# Altium project UVM AERO BSPD.PrjPcb (part 1 of 2)
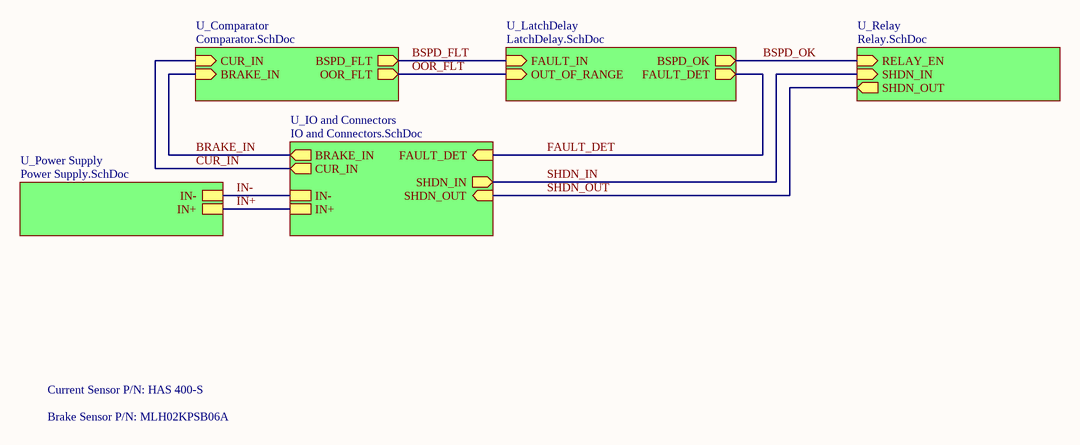
[diagram p0: TOP.SchDoc]
ProjAuth: Andrew Katz; ProjName: BSPD
7 sheets, 126 parts. Net scope: hierarchical (ports join the sheet entries above them; power ports are global).
Board file: UVM AERO BSPD.PcbDoc
Sheets:
  TOP.SchDoc
    U_Comparator = Comparator.SchDoc
    U_LatchDelay = LatchDelay.SchDoc
    U_Power Supply = Power Supply.SchDoc
    U_Relay = Relay.SchDoc
    U_IO and Connectors = IO and Connectors.SchDoc
      U_Current Scaler = Current Scaler.SchDoc

## Sheet TOP.SchDoc
size Letter; CompanyName: UVM AERO; DocumentNumber: 1; Revision: A01; SheetNumber: 1; SheetTotal: 7; DescLong2_DescShort: -

### Sub-sheets
U_Comparator = Comparator.SchDoc: OOR_FLT (out), CUR_IN (in), BSPD_FLT (out), BRAKE_IN (in)
U_IO and Connectors = IO and Connectors.SchDoc: SHDN_OUT (in), SHDN_IN (out), IN+, IN-, FAULT_DET (in), CUR_IN (out), BRAKE_IN (out)
U_LatchDelay = LatchDelay.SchDoc: FAULT_IN (in), FAULT_DET (out), BSPD_OK (out), OUT_OF_RANGE (in)
U_Power Supply = Power Supply.SchDoc: IN-, IN+
U_Relay = Relay.SchDoc: RELAY_EN (in), SHDN_IN (in), SHDN_OUT (out)

### Nets
BRAKE_IN: sheet U_Comparator/BRAKE_IN, sheet U_IO and Connectors/BRAKE_IN
BSPD_FLT: sheet U_Comparator/BSPD_FLT, sheet U_LatchDelay/FAULT_IN
BSPD_OK: sheet U_LatchDelay/BSPD_OK, sheet U_Relay/RELAY_EN
CUR_IN: sheet U_Comparator/CUR_IN, sheet U_IO and Connectors/CUR_IN
FAULT_DET: sheet U_LatchDelay/FAULT_DET, sheet U_IO and Connectors/FAULT_DET
IN+: sheet U_Power Supply/IN+, sheet U_IO and Connectors/IN+
IN-: sheet U_Power Supply/IN-, sheet U_IO and Connectors/IN-
OOR_FLT: sheet U_Comparator/OOR_FLT, sheet U_LatchDelay/OUT_OF_RANGE
SHDN_IN: sheet U_Relay/SHDN_IN, sheet U_IO and Connectors/SHDN_IN
SHDN_OUT: sheet U_Relay/SHDN_OUT, sheet U_IO and Connectors/SHDN_OUT

### Notes on the sheet
- Current Sensor P/N: HAS 400-S
- Brake Sensor P/N: MLH02KPSB06A
- Title:
- Size:
- Date:
- Desc:
- Letter
- Auth:
- Sheet
- Proj:
- of
- www.uvmaero.org
- File:

## Sheet Comparator.SchDoc
size Letter; DocumentNumber: 3; SheetNumber: 3; SheetTotal: 7
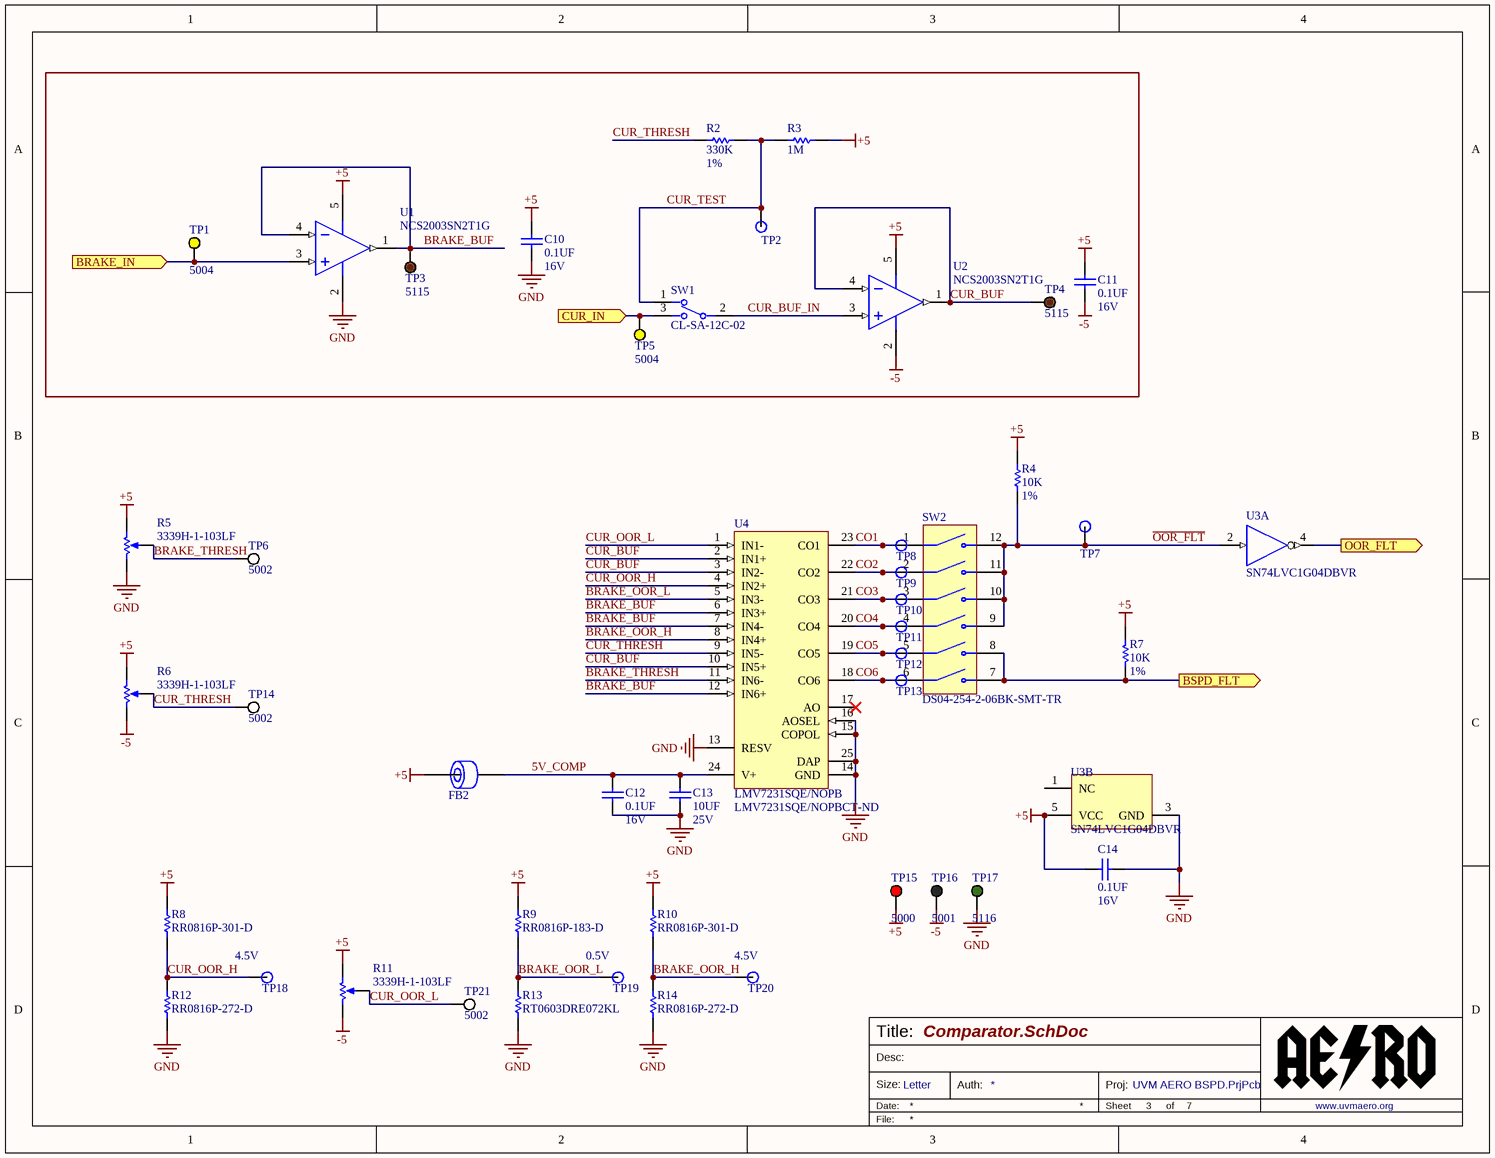
[diagram p1: Comparator.SchDoc]

### Parts
C10  Val: 0.1UF  Vol: 16V  [0603_CAP]  (hidden comment: CAP 0603 0.1UF 16V 10% X7R)
C11  Val: 0.1UF  Vol: 16V  [0603_CAP]  (hidden comment: CAP 0603 0.1UF 16V 10% X7R)
C12  Val: 0.1UF  Vol: 16V  [0603_CAP]  (hidden comment: CAP 0603 0.1UF 16V 10% X7R)
C13  Val: 10UF  Vol: 25V  [0603_CAP]  (hidden comment: CAP 0603 10UF 25V 20% X5R)
C14  Val: 0.1UF  Vol: 16V  [0603_CAP]  (hidden comment: CAP 0603 0.1UF 16V 10% X7R)
FB2  Ferrite Chip 120 Ohms  [0603]  (value not drawn)
R2  Val: 330K  Tol: 1%  [0603_RES]  (hidden comment: RES 0603 330K 1%)
R3  value 1M  [RESC2013X60X35ML10T20]  (hidden comment: RT0805BRE071ML)
R4  Val: 10K  Tol: 1%  [0603_RES]  (hidden comment: RES 0603 10K 1%)
R5  3339H-1-103LF  [3339H-1-103LF]
R6  3339H-1-103LF  [3339H-1-103LF]
R7  Val: 10K  Tol: 1%  [0603_RES]  (hidden comment: RES 0603 10K 1%)
R8  RR0816P-301-D  [RESC1608X50X30ML20T20]
R9  RR0816P-183-D  [RESC1608X50X30ML20T20]
R10  RR0816P-301-D  [RESC1608X50X30ML20T20]
R11  3339H-1-103LF  [3339H-1-103LF]
R12  RR0816P-272-D  [RESC1608X50X30NL20T20]
R13  RT0603DRE072KL  [RESC1608X55X25NL10T15]
R14  RR0816P-272-D  [RESC1608X50X30NL20T20]
SW1  CL-SA-12C-02  [CL-SA-12C-02]
SW2  DS04-254-2-06BK-SMT-TR  [*SW_DS04-254-2-06BK-SMT-TR]
TP1  5004  [KSTN-5004]
TP2  SMD Test Point  [TP_40mil]  (value not drawn)  (no BOM)
TP3  5115  [KSTN-5115]
TP4  5115  [KSTN-5115]
TP5  5004  [KSTN-5004]
TP6  5002  [KSTN-5002]
TP7  SMD Test Point  [TP_40mil]  (value not drawn)  (no BOM)
TP8  SMD Test Point  [TP_40mil]  (value not drawn)  (no BOM)
TP9  SMD Test Point  [TP_40mil]  (value not drawn)  (no BOM)
TP10  SMD Test Point  [TP_40mil]  (value not drawn)  (no BOM)
TP11  SMD Test Point  [TP_40mil]  (value not drawn)  (no BOM)
TP12  SMD Test Point  [TP_40mil]  (value not drawn)  (no BOM)
TP13  SMD Test Point  [TP_40mil]  (value not drawn)  (no BOM)
TP14  5002  [KSTN-5002]
TP15  5000  [KSTN-5000]
TP16  5001  [KSTN-5001]
TP17  5116  [KSTN-5116]
TP18  SMD Test Point  [TP_40mil]  (value not drawn)  (no BOM)
TP19  SMD Test Point  [TP_40mil]  (value not drawn)  (no BOM)
TP20  SMD Test Point  [TP_40mil]  (value not drawn)  (no BOM)
TP21  5002  [KSTN-5002]
U1  NCS2003SN2T1G  [ONSC-TSOP-5-483-02_V]
U2  NCS2003SN2T1G  [ONSC-TSOP-5-483-02_V]
U3  SN74LVC1G04DBVR  [DBV0005A_M]  (parts A,B of 2)
U4  LMV7231SQE/NOPB  Supplier Part Number 1: LMV7231SQE/NOPBCT-ND  [RTW0024A_V]

### Ports
BRAKE_IN (in), BSPD_FLT (out), CUR_IN (in), OOR_FLT (out)

### Nets
+5: C10.2 C11.2 C14.2 FB2.1 R3.2 R4.2 R5.1(CCW) R6.1(CCW) R7.1 R8.2 R9.2 R10.2 R11.1(CCW) TP15.1 U1.5(VDD) U2.5(VDD) U3.5(VCC)
-5: C11.1 R6.3(CW) R11.3(CW) TP16.1 U2.2(VSS)
GND: C10.1 C12.1 C13.1 C14.1 R5.3(CW) R12.1 R13.1 R14.1 TP17.1 U1.2(VSS) U3.3(GND) U4.13(RESV) U4.14(GND) U4.15(COPOL) U4.16(AOSEL) U4.25(DAP)
5V_COMP: C12.2 C13.2 FB2.2 U4.24(V+)
~{OOR_FLT}: R4.1 SW2.9(NO4) SW2.10(NO3) SW2.11(NO2) SW2.12(NO1) TP7.1 U3.2(A)
BRAKE_BUF: TP3.1 U1.1(VOUT) U1.4(IN-) U4.6(IN3+) U4.7(IN4-) U4.12(IN6+)
BRAKE_IN: TP1.1 U1.3(IN+) ; port BRAKE_IN
BRAKE_OOR_H: R10.1 R14.2 TP20.1 U4.8(IN4+)
BRAKE_OOR_L: R9.1 R13.2 TP19.1 U4.5(IN3-)
BRAKE_THRESH: R5.2(WIPER) TP6.1 U4.11(IN6-)
BSPD_FLT: R7.2 SW2.7(NO6) SW2.8(NO5) ; port BSPD_FLT
CO1: SW2.1(COM1) TP8.1 U4.23(CO1)
CO2: SW2.2(COM2) TP9.1 U4.22(CO2)
CO3: SW2.3(COM3) TP10.1 U4.21(CO3)
CO4: SW2.4(COM4) TP11.1 U4.20(CO4)
CO5: SW2.5(COM5) TP12.1 U4.19(CO5)
CO6: SW2.6(COM6) TP13.1 U4.18(CO6)
CUR_BUF: TP4.1 U2.1(VOUT) U2.4(IN-) U4.2(IN1+) U4.3(IN2-) U4.10(IN5+)
CUR_BUF_IN: SW1.2 U2.3(IN+)
CUR_IN: SW1.3 TP5.1 ; port CUR_IN
CUR_OOR_H: R8.1 R12.2 TP18.1 U4.4(IN2+)
CUR_OOR_L: R11.2(WIPER) TP21.1 U4.1(IN1-)
CUR_TEST: R2.2 R3.1 SW1.1 TP2.1
CUR_THRESH: R2.1 R6.2(WIPER) TP14.1 U4.9(IN5-)
OOR_FLT: U3.4(Y) ; port OOR_FLT

Not connected (* = marked no-connect by the designer): U3 1(NC); U4 17(AO)*

### Notes on the sheet
- (near TP18) 4.5V
- (near TP19) 0.5V
- (near TP20) 4.5V
- Title:
- Size:
- Date:
- Desc:
- Letter
- Auth:
- Sheet
- Proj:
- of
- www.uvmaero.org
- File:

### Library data of the parts
C10-C12 C14 = CAP 0603 0.1UF 16V 10% X7R: Capacitor Surface Mount 0603 Footprint 0.1UF 16V 10% Tolerance Ceramic X7R; Manufacturer: Various; PCB Package: 0603; Description in Visual: Cap SMT 0603 0.1UF 16V 10%  Cer X7R; P/N: CAP 0603 0.1UF 16V 10% X7R; Manufacturer P/N: Various; Value: 0.1UF; Voltage: 16V; Tolerance: 10%; Type: Ceramic X7R; ComponentLink1Description: Manufacturer Website; ComponentLink2Description: Component Datasheet; ComponentLink3Description: Octopart Link
C13 = CAP 0603 10UF 25V 20% X5R: Capacitor Surface Mount 0603 Footprint 10UF 25V 20% Tolerance Ceramic X5R; Manufacturer: Various; PCB Package: 0603; Description in Visual: Cap SMT 0603 10UF 25V 20% Ceramic X5R; P/N: CAP 0603 10UF 25V 20% X5R; Manufacturer P/N: Various; Value: 10UF; Voltage: 25V; Tolerance: 20%; Type: Ceramic X5R; ComponentLink1Description: Manufacturer Website; ComponentLink2Description: Component Datasheet; ComponentLink3Description: Octopart Link
FB2 = MMZ1608S121A: Ferrite Chip 500 mA 120 Ohms Differential Mode - Single 0603 Footprint; Manufacturer: TDK; Description in Visual: Ferrite SMT 500mA 120Ohm Dif Mode 0603; Usage: Signal Line; Current (mA): 500; Frequency: 100 MHz; Impedance at Freq (ohms): 120; DC Resistance (ohms): 0.2; P/N: MMZ1608S121A; Manufacturer P/N: MMZ1608S121A; Filter type: Differential Mode - Single; Operating Temperature Range: -55 to +125 °C; PCB Package: 0603; ComponentLink1Description: Manufacturer Website; ComponentLink1URL: http://www.tdk.com/; ComponentLink2Description: Component Datasheet; ComponentLink2URL: http://www.tdk.co.jp/tefe02/e9412_mmz1608.pdf; ComponentLink3Description: Octopart Link; ComponentLink3URL: http://octopart.com/partsearch/#search/requestData&q=MMZ1608S121A
R2 = RES 0603 330K 1%: Resistor Surface Mount, 330K Ohms, 0603 Footprint, 1% Tolerance 0.1W; Manufacturer: Various; PCB Package: 0603; Description in Visual: Res SMT 330K 0603  1%  0.1W; P/N: RES 0603 330K 1%; Manufacturer P/N: Various; Value: 330K; Power_Rating: 0.1W; Tolerance: 1%
R3 = CMP-2001-01491-1: Manufacturer: Yageo; Part Number: RT0805BRE071ML
R4 R7 = RES 0603 10K 1%: Resistor Surface Mount, 10K Ohms, 0603 Footprint, 1% Tolerance 0.1W; Manufacturer: Various; PCB Package: 0603; Description in Visual: Res SMT 10K 0603  1%  0.1W; P/N: RES 0603 10K 1%; Manufacturer P/N: Various; Value: 10K; Power_Rating: 0.1W; Tolerance: 1%
R5 R6 R11 = 3339H-1-103LF: 10 kOhms 0.5W, 1/2W PC Pins Through Hole Trimmer Potentiometer Cermet 4 Turn Top Adjustment; ComponentLink2URL: https://www.ttelectronics.com/TTElectronics/media/ProductFiles/Trimmers/Datasheets/67.pdf; ComponentLink2Description: Datasheet; Supplier 1: Digi-Key; Supplier Part Number 1: 3339H-103LF-ND
R8 R10 = CMP-2000-02599-1: Manufacturer: Susumu; Part Number: RR0816P-301-D
R9 = CMP-2000-02514-1: Manufacturer: Susumu; Part Number: RR0816P-183-D
R12 R14 = CMP-2000-02579-1: Manufacturer: Susumu; Part Number: RR0816P-272-D
R13 = CMP-2000-04621-1: Manufacturer: Yageo; Part Number: RT0603DRE072KL
SW1 = CL-SA-12C-02: Slide Switch SPDT Through Hole; Supplier 1: Digi-Key; Supplier Part Number 1: 563-1388-ND
SW2 = DS04-254-2-06BK-SMT-TR: Dip Switch SPST 6 Position Surface Mount Slide (Standard) Actuator 25mA 24VDC; Value: *; Supplier 1: Mouser; Supplier 2: Mouser; Supplier Part Number 2: 490-DS04254206BK-STR; Supplier Part Number 1: 490-DS04254206BK-STR
TP1 TP5 = 5004: Test Point, Yellow, 1-Pin THD, RoHS, Bulk; Manufacturer: KeystoneElectronics; Outside Diameter: 2.54mm; Plating: Silver; Mounting Hole Size: 1mm; Product: TestPoints; Packaging: Bulk; Manufacturer URL: http://www.keyelco.com/; Length: 7.62mm; Datasheet Version: Rev. G, 12/2008; Type: Miniature; Product Category: CircuitBoardHardware-PCB; Material: Nylon; RoHS: True; Contact Material: PhosphorBronze; Datasheet URL: https://ciiva.com/datasheet-click-2917627?src=ciiva&sig=bd195616; Color: Yellow; Brand: KeystoneElectronics; Supplier 1: Digi-Key; Supplier Part Number 1: 36-5004-ND
TP2 TP7-TP13 TP18-TP20 = TP_SMD
TP3 TP4 = 5115: Test Point, Brown, 1-Pin THD, RoHS, Bulk; Manufacturer: KeystoneElectronics; Outside Diameter: 2.54mm; Plating: Silver; Mounting Hole Size: 1mm; Product: TestPoints; Packaging: Bulk; Manufacturer URL: http://www.keyelco.com/; Length: 7.62mm; Datasheet Version: Rev. G, 12/2008; Type: Miniature; Product Category: CircuitBoardHardware-PCB; Material: Nylon; RoHS: True; Contact Material: PhosphorBronze; Datasheet URL: https://ciiva.com/datasheet-click-2917627?src=ciiva&sig=bd195616; Color: Brown; Brand: KeystoneElectronics; Supplier 1: Digi-Key; Supplier Part Number 1: 36-5115-ND
TP6 TP14 TP21 = 5002: Test Point, White, 1-Pin THD, RoHS, Bulk; Manufacturer: KeystoneElectronics; Outside Diameter: 2.54mm; Plating: Silver; Mounting Hole Size: 1mm; Product: TestPoints; Packaging: Bulk; Manufacturer URL: http://www.keyelco.com/; Length: 7.62mm; Datasheet Version: Rev. G, 12/2008; Type: Miniature; Product Category: CircuitBoardHardware-PCB; Material: Nylon; RoHS: True; Contact Material: PhosphorBronze; Datasheet URL: https://ciiva.com/datasheet-click-2917627?src=ciiva&sig=bd195616; Color: White; Brand: KeystoneElectronics; Supplier 1: Digi-Key; Supplier Part Number 1: 36-5002-ND
TP15 = 5000: Test Point, Red, 1-Pin THD, RoHS, Bulk; Manufacturer: KeystoneElectronics; Outside Diameter: 2.54mm; Plating: Silver; Mounting Hole Size: 1mm; Product: TestPoints; Packaging: Bulk; Manufacturer URL: http://www.keyelco.com/; Length: 7.62mm; Datasheet Version: Rev. G, 12/2008; Type: Miniature; Product Category: CircuitBoardHardware-PCB; Material: Nylon; RoHS: True; Contact Material: PhosphorBronze; Datasheet URL: https://ciiva.com/datasheet-click-2917627?src=ciiva&sig=bd195616; Color: Red; Brand: KeystoneElectronics; Supplier 1: Digi-Key; Supplier Part Number 1: 36-5000-ND
TP16 = 5001: Test Point, Black, 1-Pin THD, RoHS, Bulk; Manufacturer: KeystoneElectronics; Outside Diameter: 2.54mm; Plating: Silver; Mounting Hole Size: 1mm; Product: TestPoints; Packaging: Bulk; Manufacturer URL: http://www.keyelco.com/; Length: 7.62mm; Datasheet Version: Rev. G, 12/2008; Type: Miniature; Product Category: CircuitBoardHardware-PCB; Material: Nylon; RoHS: True; Contact Material: PhosphorBronze; Datasheet URL: https://ciiva.com/datasheet-click-2917627?src=ciiva&sig=bd195616; Color: Black; Brand: KeystoneElectronics; Supplier 1: Digi-Key; Supplier Part Number 1: 36-5001-ND
TP17 = 5116: Test Point, Green, 1-Pin THD, RoHS, Bulk; Manufacturer: KeystoneElectronics; Outside Diameter: 2.54mm; Plating: Silver; Mounting Hole Size: 1mm; Product: TestPoints; Packaging: Bulk; Manufacturer URL: http://www.keyelco.com/; Length: 7.62mm; Datasheet Version: Rev. G, 12/2008; Type: Miniature; Product Category: CircuitBoardHardware-PCB; Material: Nylon; RoHS: True; Contact Material: PhosphorBronze; Datasheet URL: https://ciiva.com/datasheet-click-2917627?src=ciiva&sig=bd195616; Color: Green; Brand: KeystoneElectronics; Supplier 1: Digi-Key; Supplier Part Number 1: 36-5116-ND
U1 U2 = CMP-1310-00381-1: Low Voltage, Rail-to-Rail Output Operational Amplifier, 1.7 to 5.5 V, -40 to 85 degC, 5-Pin TSOP, Pb-Free, Tape and Reel; Manufacturer: On Semiconductor; VCC Max (V): 5.5; VCC Min (V): 1.7; ComponentLink3URL: http://www.onsemi.com/pub_link/Collateral/483.PDF; Packing: Tape and Reel; ComponentLink1URL: http://www.onsemi.com/; PackageReference: TSOP-5-483-02; Mounting Technology: Surface Mount; PackageVersion: Rev. K, 04/2013; PartNumber: NCS2003SN2T1G; DatasheetVersion: Rev. 3; ComponentLink2URL: http://www.onsemi.cn/pub_link/Collateral/NCS2003-D.PDF; ComponentLink2Description: Datasheet; ComponentLink3Description: Package Specification; RoHS: TRUE; PackageDescription: 5-Pin Small Outline Package, Body 3 x 1.5 mm, Pitch 0.95 mm; ComponentLink1Description: Manufacturer URL
U3 = CMP-0859-00134-3: Single Inverter, DBV0005A, LARGE T&R; Manufacturer: Texas Instruments; 3-State Output: No; Sub-Family: Inverting Buffer/Driver; Logic: Inverting; Rating: Catalog; VCC(Max)(V): 5.5; ICC @ Nom Voltage(Max)(mA): 0.01; Output Type: CMOS; Output Drive (IOL/IOH)(Max)(mA): 32/-32; tpd @ Nom Voltage(Max)(ns): 7.5,5.2,4.2,3.7; Technology Family: LVC; Input Type: CMOS/TTL; Bits(#): 1; F @ Nom Voltage(Max)(Mhz): 150; VCC(Min)(V): 1.65; Voltage(Nom)(V): 1.8,2.5,3.3,5; DatasheetVersion: SCES214AD; Schmitt Trigger: No; Operating Temperature Range(C): -40 to 125,-40 to 85; PackageReference: DBV0005A; Generic Part Number: SN74LVC1G04
U4 = LMV7231SQE/NOPB: Hex Window Comparator with 1.5% Precision and 400mV Reference, 24-pin LLP, 250 Reel; Manufacturer: Texas Instruments; PowerWise: N; PackageTopMarking: NS*UZXYTT*L7231SQ; Code_JEDEC: MO-220-WGGD-6; PinCount: 24; ComponentLink1Description: Datasheet URL; PackageDescription: LLP, Plastic, Quad, 4 x 4 x 0.8mm Body, 24 Lead, 0.5mm Pitch, No Pullback; PackageReference: RTW0024A; CompType: Comparator; RoHS: Y; ComponentLink1URL: http://www.ti.com/general/docs/lit/getliterature.tsp?genericPartNumber=LMV7231&fileType=pdf; Supplier 1: Digi-Key

## Sheet LatchDelay.SchDoc
size Letter; DocumentNumber: 4; SheetNumber: 4; SheetTotal: 7
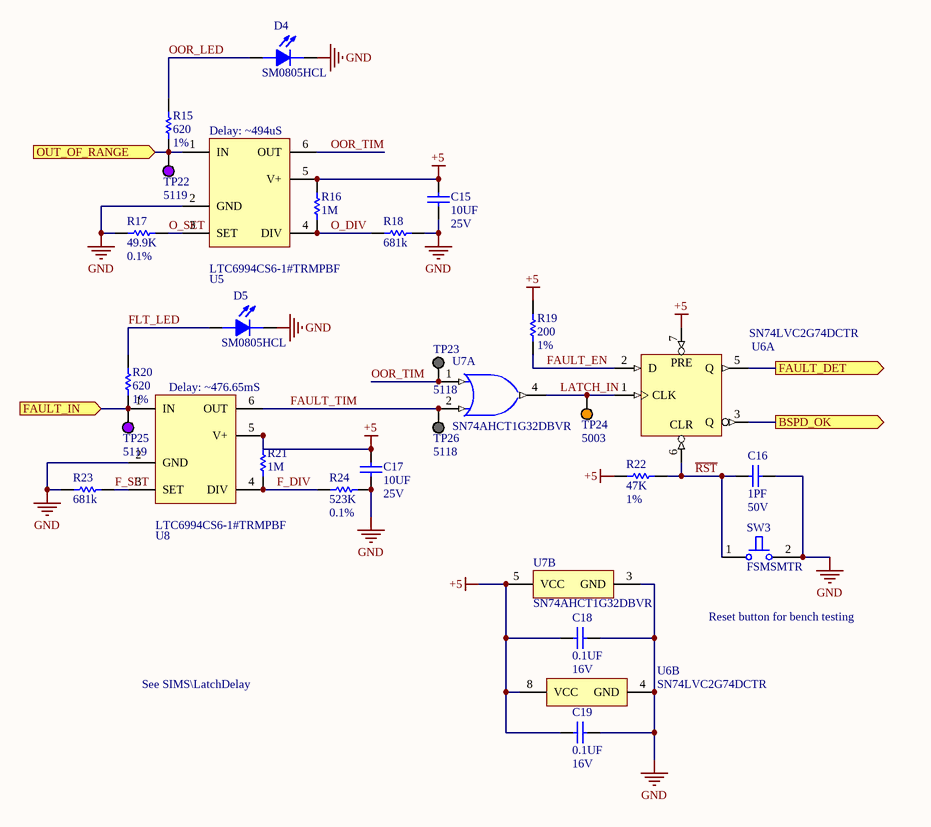
[diagram p2: LatchDelay.SchDoc]

### Parts
C15  Val: 10UF  Vol: 25V  [0603_CAP]  (hidden comment: CAP 0603 10UF 25V 20% X5R)
C16  Val: 1PF  Vol: 50V  [0603_CAP]  (hidden comment: CAP 0603 1PF 50V 0.05PF MLO)
C17  Val: 10UF  Vol: 25V  [0603_CAP]  (hidden comment: CAP 0603 10UF 25V 20% X5R)
C18  Val: 0.1UF  Vol: 16V  [0603_CAP]  (hidden comment: CAP 0603 0.1UF 16V 10% X7R)
C19  Val: 0.1UF  Vol: 16V  [0603_CAP]  (hidden comment: CAP 0603 0.1UF 16V 10% X7R)
D4  SM0805HCL  [LEDC2012X135N_SM0805HCL(Primary)]
D5  SM0805HCL  [LEDC2012X135N_SM0805HCL(Primary)]
R15  Val: 620  Tol: 1%  [0603_RES]  (hidden comment: RES 0603 620 1%)
R16  value 1M  [RESC2013X60X35ML10T20]  (hidden comment: RT0805BRE071ML)
R17  Val: 49.9K  Tol: 0.1%  [0603_RES]  (hidden comment: RES 0603 49.9K 0.1%)
R18  value 681k  [RESC2013X60X40NL20T25]  (hidden comment: ERA6AEB6813V)
R19  Val: 200  Tol: 1%  [0603_RES]  (hidden comment: RES 0603 200 1%)
R20  Val: 620  Tol: 1%  [0603_RES]  (hidden comment: RES 0603 620 1%)
R21  value 1M  [RESC2013X60X35ML10T20]  (hidden comment: RT0805BRE071ML)
R22  Val: 47K  Tol: 1%  [0603_RES]  (hidden comment: RES 0603 47K 1%)
R23  value 681k  [RESC2013X60X40NL20T25]  (hidden comment: ERA6AEB6813V)
R24  Val: 523K  Tol: 0.1%  [0805_RES]  (hidden comment: RES 0805 523K 0.1%)
SW3  FSMSMTR  [TECO-FSMSMTR_V]
TP22  5119  [KSTN-5119]
TP23  5118  [KSTN-5118]
TP24  5003  [KSTN-5003]
TP25  5119  [KSTN-5119]
TP26  5118  [KSTN-5118]
U5  LTC6994CS6-1#TRMPBF  [Linear_Technologies_LTC6994CS6-1#TRMPBF_0]  (value not drawn)
U6  SN74LVC2G74DCTR  [DCT0008A_M]  (parts A,B of 2)
U7  SN74AHCT1G32DBVR  [DBV0005A_M]  (parts A,B of 2)
U8  LTC6994CS6-1#TRMPBF  [Linear_Technologies_LTC6994CS6-1#TRMPBF_0]  (value not drawn)

### Ports
BSPD_OK (out), FAULT_DET (out), FAULT_IN (in), OUT_OF_RANGE (in)

### Nets
+5: C15.2 C17.2 C18.2 C19.2 R16.2 R19.2 R21.2 R22.1 U5.5(V+) U6.7(~{PRE}) U6.8(VCC) U7.5(VCC) U8.5(V+)
GND: C15.1 C16.2 C17.1 C18.1 C19.1 D4.C D5.C R17.1 R18.2 R23.1 R24.2 SW3.2 U5.2(GND) U6.4(GND) U7.3(GND) U8.2(GND)
~{RST}: C16.1 R22.2 SW3.1 U6.6(~{CLR})
BSPD_FLT: R20.1 TP25.1 U8.1(IN) ; port FAULT_IN
BSPD_OK: U6.3(Q) ; port BSPD_OK
F_DIV: R21.1 R24.1 U8.4(DIV)
F_SET: R23.2 U8.3(SET)
FAULT_DET: U6.5(Q) ; port FAULT_DET
FAULT_EN: R19.1 U6.2(D)
FAULT_TIM: TP26.1 U7.2(B) U8.6(OUT)
FLT_LED: D5.A R20.2
LATCH_IN: TP24.1 U6.1(CLK) U7.4(Y)
O_DIV: R16.1 R18.1 U5.4(DIV)
O_SET: R17.2 U5.3(SET)
OOR_FLT: R15.1 TP22.1 U5.1(IN) ; port OUT_OF_RANGE
OOR_LED: D4.A R15.2
OOR_TIM: TP23.1 U5.6(OUT) U7.1(A)

### Notes on the sheet
- (near U5) Delay: ~494uS
- (near U8) Delay: ~476.65mS
- Reset button for bench testing
- See SIMS\LatchDelay
- Title:
- Size:
- Date:
- Desc:
- Letter
- Auth:
- Sheet
- Proj:
- of
- www.uvmaero.org
- File:
- (in symbol CMP-0859-00537-3, part A) PRE; CLR

### Library data of the parts
C15 C17 = CAP 0603 10UF 25V 20% X5R: as C13 on sheet Comparator; P/N: CAP 0603 10UF 25V 20% X5R; Manufacturer P/N: Various; Value: 10UF; Voltage: 25V; Tolerance: 20%; Type: Ceramic X5R; ComponentLink1Description: Manufacturer Website; ComponentLink2Description: Component Datasheet; ComponentLink3Description: Octopart Link
C16 = CAP 0603 1PF 50V 0.05PF MLO: Capacitor Surface Mount 0603 Footprint 1PF 50V 0.05PF Tolerance MLO; Manufacturer: Various; PCB Package: 0603; Description in Visual: Cap SMT 0603 1PF 50V 0.05PF  MLO; P/N: CAP 0603 1PF 50V 0.05PF MLO; Manufacturer P/N: Various; Value: 1PF; Voltage: 50V; Tolerance: 0.05PF; Type: MLO; ComponentLink1Description: Manufacturer Website; ComponentLink2Description: Component Datasheet; ComponentLink3Description: Octopart Link
C18 C19 = CAP 0603 0.1UF 16V 10% X7R: as C10 on sheet Comparator; P/N: CAP 0603 0.1UF 16V 10% X7R; Manufacturer P/N: Various; Value: 0.1UF; Voltage: 16V; Tolerance: 10%; Type: Ceramic X7R; ComponentLink1Description: Manufacturer Website; ComponentLink2Description: Component Datasheet; ComponentLink3Description: Octopart Link
D4 D5 = SM0805HCL: Red 631nm LED Indication - Discrete 1.9V 0805 (2012 Metric); Supplier 1: Digi-Key; Supplier Part Number 1: 492-2281-1-ND
R15 R20 = RES 0603 620 1%: Resistor Surface Mount, 620 Ohms, 0603 Footprint, 1% Tolerance 0.1W; Manufacturer: Various; PCB Package: 0603; Description in Visual: Res SMT 620 0603  1%  0.1W; Value: 620; P/N: RES 0603 620 1%; Manufacturer P/N: Various; Power_Rating: 0.1W; Tolerance: 1%
R16 R21 = CMP-2001-01491-1: Manufacturer: Yageo; Part Number: RT0805BRE071ML
R17 = RES 0603 49.9K 0.1%: Resistor Surface Mount, 49.9K Ohms, 0603 Footprint, 0.1% Tolerance 0.1W; Manufacturer: Various; PCB Package: 0603; Description in Visual: Res SMT 49.9K 0603  0.1%  0.1W; P/N: RES 0603 49.9K 0.1%; Manufacturer P/N: Various; Value: 49.9K; Power_Rating: 0.1W; Tolerance: 0.1%
R18 R23 = CMP-2001-00870-1: Manufacturer: Panasonic; Part Number: ERA6AEB6813V
R19 = RES 0603 200 1%: Resistor Surface Mount, 200 Ohms, 0603 Footprint, 1% Tolerance 0.1W; Manufacturer: Various; PCB Package: 0603; Description in Visual: Res SMT 200 0603  1%  0.1W; Value: 200; P/N: RES 0603 200 1%; Manufacturer P/N: Various; Power_Rating: 0.1W; Tolerance: 1%
R22 = RES 0603 47K 1%: Resistor Surface Mount, 47K Ohms, 0603 Footprint, 1% Tolerance 0.1W; Manufacturer: Various; PCB Package: 0603; Description in Visual: Res SMT 47K 0603  1%  0.1W; P/N: RES 0603 47K 1%; Manufacturer P/N: Various; Value: 47K; Power_Rating: 0.1W; Tolerance: 1%
R24 = RES 0805 523K 0.1%: Resistor Surface Mount, 523K Ohms, 0805 Footprint, 0.1% Tolerance 0.125W; Manufacturer: Various; PCB Package: 0805; Description in Visual: Res SMT 523K 0805  0.1%  0.125W; P/N: RES 0805 523K 0.1%; Manufacturer P/N: Various; Value: 523K; Power_Rating: 0.125W; Tolerance: 0.1%
SW3 = FSMSMTR: FSMSM Push Button Switch, 50 mA, -35 to 85 degC, 2-Pin SMD, RoHS, Tape and Reel; Manufacturer: TE Connectivity; Voltage Rating (DC): 24V; Electrical Life: 20000Cycles; Operating Force: 180gf; Switch Travel: 0.25mm; Contact Current Rating: 50mA; Case\/Package: SMD/SMT; Actuator Length: 1.07mm; Throw Configuration: SPST; Actuator Material: Polyamide; Contact Resistance: 100mOhm; Illumination Type: Illuminated; Max Voltage Rating (DC): 12V; Manufacturer URL: http://www.te.com/; Lead Free: LeadFree; Packaging: TapeandReel; Min Operating Temperature: -35degC; Mechanical Life: 20000Cycles; Mount: SurfaceMount; REACH SVHC: Unknown; Package Quantity: 1800; Package Reference: FSMSMTR; RoHSCompliant: true; Max Operating Temperature: 85degC; Orientation: Straight; ELV: Compliant; Datasheet URL: http://www.te.com/commerce/DocumentDelivery/DDEController?Action=showdoc&DocId=Customer+Drawing%7F1437566-3%7FC2%7Fpdf%7FEnglish%7FENG_CD_1437566-3_C2_1437566_3_1_c.dwg.pdf%7F1437566-4; Package Description: 2-Pin Surface Mount Device, Body 6 x 3.5 mm, Pitch 9.19 mm; Current Rating: 50mA; Contact Plating: Silver; Termination: GullWing; Datasheet Version: Rev. C2, 08/2014; Contact Material: Brass; Mounting Technology: SurfaceMount; Manufacturer 1: TE Connectivity; Manufacturer Part Number 1: FSMSMTR; Supplier 1: Digi-Key; Supplier Part Number 1: 450-1758-1-ND
TP22 TP25 = 5119: Test Point, Purple, 1-Pin THD, RoHS, Bulk; Manufacturer: KeystoneElectronics; Outside Diameter: 2.54mm; Plating: Silver; Mounting Hole Size: 1mm; Product: TestPoints; Packaging: Bulk; Manufacturer URL: http://www.keyelco.com/; Length: 7.62mm; Datasheet Version: Rev. G, 12/2008; Type: Miniature; Product Category: CircuitBoardHardware-PCB; Material: Nylon; RoHS: True; Contact Material: PhosphorBronze; Datasheet URL: https://ciiva.com/datasheet-click-2917627?src=ciiva&sig=bd195616; Color: Purple; Brand: KeystoneElectronics; Supplier 1: Digi-Key; Supplier Part Number 1: 36-5119-ND
TP23 TP26 = 5118: Test Point, Grey, 1-Pin THD, RoHS, Bulk; Manufacturer: KeystoneElectronics; Outside Diameter: 2.54mm; Plating: Silver; Mounting Hole Size: 1mm; Product: TestPoints; Packaging: Bulk; Manufacturer URL: http://www.keyelco.com/; Length: 7.62mm; Datasheet Version: Rev. G, 12/2008; Type: Miniature; Product Category: CircuitBoardHardware-PCB; Material: Nylon; RoHS: True; Contact Material: PhosphorBronze; Datasheet URL: https://ciiva.com/datasheet-click-2917627?src=ciiva&sig=bd195616; Color: Grey; Brand: KeystoneElectronics; Supplier 1: Digi-Key; Supplier Part Number 1: 36-5118-ND
TP24 = 5003: Test Point, Orange, 1-Pin THD, RoHS, Bulk; Manufacturer: KeystoneElectronics; Outside Diameter: 2.54mm; Plating: Silver; Mounting Hole Size: 1mm; Product: TestPoints; Packaging: Bulk; Manufacturer URL: http://www.keyelco.com/; Length: 7.62mm; Datasheet Version: Rev. G, 12/2008; Type: Miniature; Product Category: CircuitBoardHardware-PCB; Material: Nylon; RoHS: True; Contact Material: PhosphorBronze; Datasheet URL: https://ciiva.com/datasheet-click-2917627?src=ciiva&sig=bd195616; Color: Orange; Brand: KeystoneElectronics; Supplier 1: Digi-Key; Supplier Part Number 1: 36-5003-ND
U5 U8 = LTC6994CS6-1#TRMPBF: IC DELAY LINE 8TAP PROG TSOT23-6; Manufacturer: Linear Technologies; Capacitance: SKIP; Library Path1: parts/IC_Linear_Technologies_LTC6994CS6-1#TRMPBF_eec.SchLib; Value: SKIP; Part Number: LTC6994CS6-1#TRMPBF; Datasheet Path: datasheets/IC_Linear_Technologies_LTC6994CS6-1#TRMPBF_eec.pdf; ComponentLink1Description: Upverter; ComponentLink1URL: https://upverter.com/upn/revision/f62c3d807553aaaa/; ComponentLink2Description: Datasheet; ComponentLink2URL: http://cds.linear.com/docs/en/datasheet/699412fb.pdf; Datasheet Path1: datasheets/IC_Linear_Technologies_LTC6994CS6-1#TRMPBF_eec.pdf; Digikey Description: IC DELAY LINE 8TAP PROG TSOT23-6; Digikey Part Number: LTC6994CS6-1#TRMPBFCT-ND; Inductance: SKIP; Lead Free: yes; Library Ref1: LTC6994CS6-1#TRMPBF; Mouser Part Number: 584-C6994CS6-1TRMPBF; Package: TSOT23-6; Price: 2.01987952065; Resistance: SKIP; RoHS: TRUE; Supplier 1: Digi-Key; Supplier 2: Mouser; Supplier Part Number 1: LTC6994CS6-1#TRMPBFCT-ND; Supplier Part Number 2: 584-C6994CS6-1TRMPBF; Temperature: 0°C to +70°C; Temperature Range High: +70°C; Temperature Range Low: 0°C; Voltage: SKIP; helpURL: https://upverter.com/upn/revision/f62c3d807553aaaa/
U6 = CMP-0859-00537-3: Single Positive-Edge-Triggered D-Type Flip-Flop with Clear and Preset, DCT0008A, LARGE T&R; Manufacturer: Texas Instruments; Output Type: CMOS; Schmitt Trigger: No; ICC @ Nom Voltage(Max)(mA): 0.01; VCC(Max)(V): 5.5; Output Drive (IOL/IOH)(Max)(mA): 32/-32; Input Type: CMOS/TTL; Rating: Catalog; Technology Family: LVC; Bits(#): 1; F @ Nom Voltage(Max)(Mhz): 150; tpd @ Nom Voltage(Max)(ns): 13.4,7.1,5.9,4.1; Voltage(Nom)(V): 1.8,2.5,3.3,5; Logic: True; VCC(Min)(V): 1.65; Operating Temperature Range(C): -40 to 125,-40 to 85; Sub-Family: D-Type Flip-Flop; Generic Part Number: SN74LVC2G74; 3-State Output: No; PackageReference: DCT0008A; DatasheetVersion: SCES203O
U7 = CMP-0859-00067-3: Single 2-Input Positive-OR Gate, DBV0005A, LARGE T&R; Manufacturer: Texas Instruments; Technology Family: AHCT; VCC(Min)(V): 2; Voltage(Nom)(V): 5; Schmitt Trigger: No; Gate Type: OR; Sub-Family: OR Gate; Input Type: CMOS; ICC @ Nom Voltage(Max)(mA): 0.01; VCC(Max)(V): 5.5; Bits(#): 1; F @ Nom Voltage(Max)(Mhz): 75; Output Drive (IOL/IOH)(Max)(mA): 8/-8; tpd @ Nom Voltage(Max)(ns): 8; Logic: True; Rating: Catalog; Operating Temperature Range(C): -40 to 125; Generic Part Number: SN74AHCT1G32; DatasheetVersion: SCLS320O; PackageReference: DBV0005A; 3-State Output: No; Output Type: CMOS

## Sheet Power Supply.SchDoc
size Letter; DocumentNumber: 2; SheetNumber: 2; SheetTotal: 7
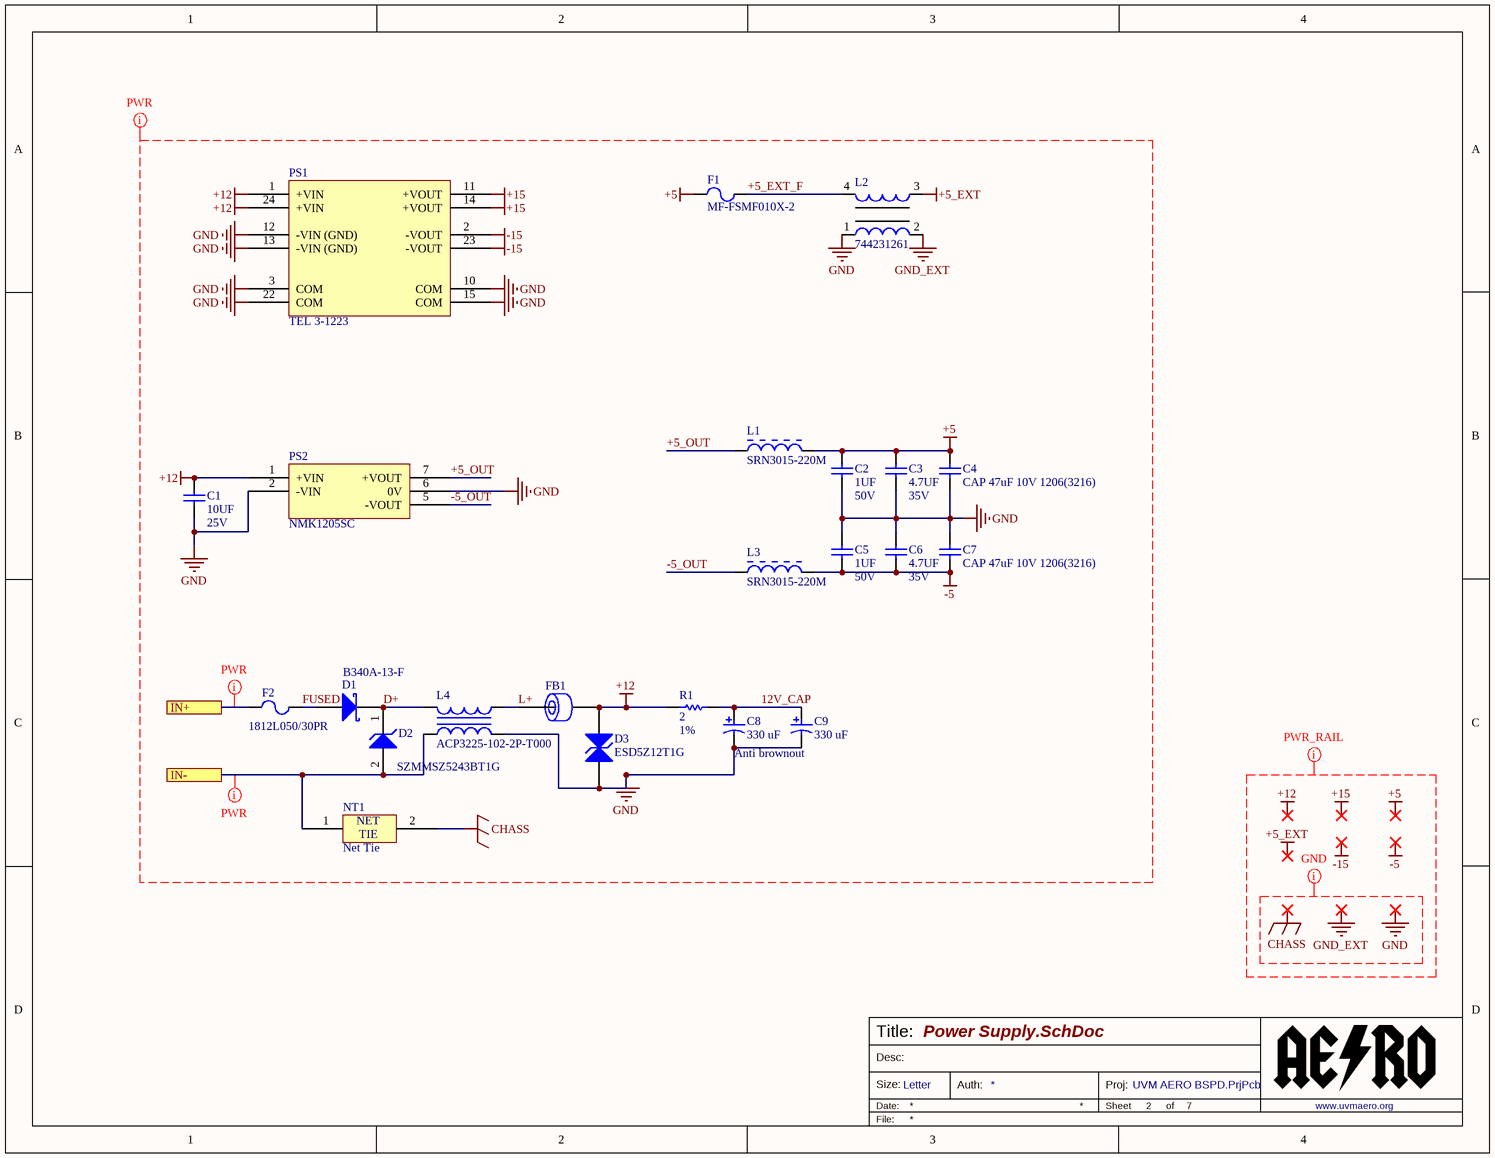
[diagram p3: Power Supply.SchDoc]

### Parts
C1  Val: 10UF  Vol: 25V  [0603_CAP]  (hidden comment: CAP 0603 10UF 25V 20% X5R)
C2  Val: 1UF  Vol: 50V  [0603_CAP]  (hidden comment: CAP 0603 1UF 50V 10% X7R)
C3  Val: 4.7UF  Vol: 35V  [0805_CAP]  (hidden comment: CAP 0805 4.7UF 35V 10% X7R)
C4  CAP 47uF 10V 1206(3216)  [CAPC1206(3216)190_N]
C5  Val: 1UF  Vol: 50V  [0603_CAP]  (hidden comment: CAP 0603 1UF 50V 10% X7R)
C6  Val: 4.7UF  Vol: 35V  [0805_CAP]  (hidden comment: CAP 0805 4.7UF 35V 10% X7R)
C7  CAP 47uF 10V 1206(3216)  [CAPC1206(3216)190_N]
C8  Rated Capacitance: 330 uF  [NIC-CAPA2-10X10_V]  (hidden comment: UUD1V331MNL1GS)
C9  Rated Capacitance: 330 uF  [NIC-CAPA2-10X10_V]  (hidden comment: UUD1V331MNL1GS)
D1  B340A-13-F  [DIOD-SMA-2_V]
D2  SZMMSZ5243BT1G  [ONSC-SOD-123-2-425-04_V]
D3  ESD5Z12T1G  [ONSC-SOD-523-2-502-01_V]
F1  MF-FSMF010X-2  [MF-FSMF]
F2  1812L050/30PR  [LFUS-1812L05030PR]
FB1  Ferrite Chip 1500 Ohms  [0805]  (value not drawn)
L1  SRN3015-220M  [SRN3015-2_V]
L2  744231261  [WE-CNSW-0805]
L3  SRN3015-220M  [SRN3015-2_V]
L4  ACP3225-102-2P-T000  [TDK-ACP3225-102-2P-T000-4_V]
NT1  Net Tie  [20MIL_TIE]  (net tie, no BOM)
PS1  TEL 3-1223  [TEL 3-1223]
PS2  NMK1205SC  [NMV0505SC]
R1  Val: 2  Tol: 1%  [0805_RES]  (hidden comment: RES 0805 2 1%)

### Ports
IN+, IN-

### Nets
+5: C2.2 C3.2 C4.2 F1.1 L1.2
+5_EXT: L2.3
+12: C1.2 D3.1(A1) FB1.2 PS1.1(+VIN) PS1.24(+VIN) PS2.1(+VIN) R1.1
+15: PS1.11(+VOUT) PS1.14(+VOUT)
-5: C5.1 C6.1 C7.1 L3.2
-15: PS1.2(-VOUT) PS1.23(-VOUT)
CHASS: NT1.2
GND: C1.1 C2.1 C3.1 C4.1 C5.2 C6.2 C7.2 C8.2 C9.2 D3.2(A2) L2.1 L4.3 PS1.3(COM) PS1.10(COM) PS1.12(-VIN_(GND)) PS1.13(-VIN_(GND)) PS1.15(COM) PS1.22(COM) PS2.2(-VIN) PS2.6(0V)
GND_EXT: L2.2
12V_CAP: C8.1 C9.1 R1.2
+5_EXT_F: F1.2 L2.4
+5_OUT: L1.1 PS2.7(+VOUT)
-5_OUT: L3.1 PS2.5(-VOUT)
D+: D1.2(K) D2.1(K) L4.1
FUSED: D1.1(A) F2.2
IN+: F2.1 ; port IN+
IN-: D2.2(A) L4.2 NT1.1 ; port IN-
L+: FB1.1 L4.4

### Layout directives
net class GND_RAIL: CHASS, GND, GND_EXT
net class PWR; net class PWR_RAIL: +5, +5_EXT, +12, +15, -5, -15, CHASS, GND, GND_EXT, IN+, IN-
net class PWR: 12V_CAP, +5, +5_EXT, +5_EXT_F, +5_OUT, +12, +15, -5, -5_OUT, -15, CHASS, D+, FUSED, GND, GND_EXT, L+

### Notes on the sheet
- Anti brownout
- Labels drawn without touching a wire or pin: +5, +5_EXT, +12, +15, -5, -15, CHASS, GND, GND_EXT
- Title:
- Size:
- Date:
- Desc:
- Letter
- Auth:
- Sheet
- Proj:
- of
- www.uvmaero.org
- File:
- (in symbol NET TIE) NET; TIE

### Library data of the parts
C1 = CAP 0603 10UF 25V 20% X5R: as C13 on sheet Comparator; P/N: CAP 0603 10UF 25V 20% X5R; Manufacturer P/N: Various; Value: 10UF; Voltage: 25V; Tolerance: 20%; Type: Ceramic X5R; ComponentLink1Description: Manufacturer Website; ComponentLink2Description: Component Datasheet; ComponentLink3Description: Octopart Link
C2 C5 = CAP 0603 1UF 50V 10% X7R: Capacitor Surface Mount 0603 Footprint 1UF 50V 10% Tolerance Ceramic X7R; Manufacturer: Various; PCB Package: 0603; Description in Visual: Cap SMT 0603 1UF 50V 10% Ceramic X7R; P/N: CAP 0603 1UF 50V 10% X7R; Manufacturer P/N: Various; Value: 1UF; Voltage: 50V; Tolerance: 10%; Type: Ceramic X7R; ComponentLink1Description: Manufacturer Website; ComponentLink2Description: Component Datasheet; ComponentLink3Description: Octopart Link
C3 C6 = CAP 0805 4.7UF 35V 10% X7R: Capacitor Surface Mount 0805 Footprint 4.7UF 35V 10% Tolerance Ceramic X7R; Manufacturer: Various; PCB Package: 0805; Description in Visual: Cap SMT 0805 4.7UF 35V 10%  Cer X7R; P/N: CAP 0805 4.7UF 35V 10% X7R; Manufacturer P/N: Various; Value: 4.7UF; Voltage: 35V; Tolerance: 10%; Type: Ceramic X7R; ComponentLink1Description: Manufacturer Website; ComponentLink2Description: Component Datasheet; ComponentLink3Description: Octopart Link
C4 C7 = CMP-1037-05002-1: CAP 47uF 10V ±20% 1206 (3216 Metric) Thickness 1.9mm SMD; Case-Metric: 3216; Case-EIA: 1206; Tolerance: Â±20%; Technology: SMT; Rated Voltage: 10 V; Value: 47uF; Max Thickness: 1.9 mm
C8 C9 = UUD1V331MNL1GS: Aluminum Electrolytic Capacitor, UD Series, Low Impedance, 330 uF, 35 V, + / - 20%, -55 to 105 degC, Chip Type, 10 x 10 mm D x L, Pb-Free, Reel; Manufacturer: Nichicon; Tolerance Rated Capacitance: -20 to 20%; Packing: Dia382mm Reel; Rated Voltage: 35 V; Rated Ripple Current (at 100kHz): 670 mA; Impedance: 0.09 Ohm; Endurance Time: 5000 h; Mounting Technology: Surface Mount; ComponentLink1Description: Manufacturer URL; PackageReference: CAPAE-D10H10; PartNumber: UUD1V331MNL1GS; ComponentLink2Description: Datasheet; Diameter: 10 mm; PackageDescription: 2-Pin Surface Mount Device, Diameter 10 mm, Height 10 mm, Pitch 8 mm; ComponentLink2URL: http://products.nichicon.co.jp/en/pdf/XJA043/e-ud.pdf; Length: 10 mm; ComponentLink3URL: http://products.nichicon.co.jp/en/pdf/XJA043/e-ud.pdf; DatasheetVersion: 08/2012; ComponentLink3Description: Package Specification; ComponentLink1URL: http://www.nichicon.co.jp/; RoHS: TRUE; Manufacturer 1: Nichicon; Manufacturer Part Number 1: UUD1V331MNL1GS; Supplier 1: Digi-Key; Supplier Part Number 1: 493-2293-1-ND
D1 = CMP-1667-00003-1: Surface Mount Schottky Barrier Rectifier, 40 V, 3 A, -55 to 150 degC, 2-Pin SMA, RoHS, Tape and Reel; Forward Current: 3 A; Forward Voltage: 500 mV; Max Surge Current: 80 A; Peak Reverse Current: 500 uA; Elements: 1; Mounting Technology: Surface Mount; ComponentLink1URL: http://www.diodes.com/; PackageDescription: 2-Pin Surface Mounted Assembly, Body 4.3 x 2.605 mm, Height 2.4 mm; Min Operating Temperature: -55 degC; Mount: Surface Mount; Pins: 2; ComponentLink2URL: http://www.diodes.com/_files/datasheets/ds30891.pdf; PackageReference: SMA-2; Max Operating Temperature: 125 degC; Radiation Hardening: No; Length: 4.6 mm; RoHSCompliant: true; ComponentLink1Description: Manufacturer URL; Height: 2.1 mm; ComponentLink2Description: Datasheet; Packaging: Tape and Reel; Package Quantity: 5000; Case\Package: SMA; DatasheetVersion: Rev. 17 - 2, 09/2015; REACH SVHC: No SVHC; Width: 2.92 mm
D2 = CMP-1060-00481-1: Zener Voltage Regulator, 500 mW, 2-Pin SOD-123, Pb-Free, Tape and Reel; Manufacturer: On Semiconductor; VZ Typ (V): 13; P Max (W): 0.5; DatasheetVersion: Rev. 12; RoHS: Pb-Free; PartNumber: SZMMSZ5243BT1G; ComponentLink3Description: Package Specification; ComponentLink1URL: http://www.onsemi.com/; PackageReference: SOD-123-2-425-04; ComponentLink2Description: Datasheet; PackageVersion: Rev. G, 10/2009; Packing: Tape and Reel; Mounting Technology: Surface Mount; ComponentLink1Description: Manufacturer URL; PackageDescription: 2-Pin SOD, Body 1.6 x 2.69 mm; ComponentLink2URL: http://www.onsemi.cn/pub_link/Collateral/MMSZ5221BT1-D.PDF; ComponentLink3URL: http://www.onsemi.com/pub_link/Collateral/425-04.PDF
D3 = ESD5Z12T1G: Transient Voltage Suppressor, Micro-Packaged Diode for ESD Protection, 2-Pin SOD-523, Pb-Free, Tape and Reel; Manufacturer: On Semiconductor; VRWM Max (V): 12; Number of Lines: 1; V(BR) Min (V): 14.1; Direction: Unidirectional; IR Max (uA): 0.01; PPK Max (W): 240; ComponentLink1URL: http://www.onsemi.com/; PartNumber: ESD5Z12T1G; RoHS: Pb-Free; ComponentLink3Description: Package Specification; PackageVersion: Rev. E, 09/2010; PackageReference: SOD-523-2-502-01; PackageDescription: 2-Pin SOD, Body 1.2 x 0.8 mm; ComponentLink2Description: Datasheet; ComponentLink1Description: Manufacturer URL; Mounting Technology: Surface Mount; DatasheetVersion: Rev. 10; ComponentLink3URL: http://www.onsemi.com/pub_link/Collateral/502-01.PDF; ComponentLink2URL: http://www.onsemi.cn/pub_link/Collateral/ESD5Z2.5T1-D.PDF; Packing: Tape and Reel; Manufacturer 1: ON Semiconductor; Manufacturer Part Number 1: ESD5Z12T1G; Supplier 1: Digi-Key; Supplier Part Number 1: ESD5Z12T1GOSCT-ND
F1 = MF-FSMF010X-2: Polymeric PTC Resettable Fuse 15V 100mA Ih Surface Mount 0603 (1608 Metric), Concave; Supplier 1: Digi-Key; Supplier Part Number 1: MF-FSMF010X-2CT-ND
F2 = 1812L050/30PR: PTC Resettable Fuse, 0.8 W, 30 V, -40 to 85 degC, 2-Pin SMD, RoHS, Tape and Reel; Manufacturer: Littelfuse-Inc.; Manufacturer 1: Littelfuse; Voltage - Max: 30V; Current - Hold (Ih) (Max): 500mA; Time to Trip: 0.15s; Current - Max: 100A; R Min/Max: 0.150~1.000Ohm; Current - Trip (It): 1A; Package Reference: 1812; Family: PTCResettableFuses; Packaging: Tape&Reel(TR); Package / Case: 1812(4532Metric),Concave; Series: POLY-FUSE®,1812L; Mounting Technology: SurfaceMount; Datasheet Version: 02/2016; Datasheet URL: http://www.littelfuse.com/~/media/electronics/datasheets/resettable_ptcs/littelfuse_ptc_1812l_datasheet.pdf.pdf; Manufacturer URL: http://www.littelfuse.com/; Category: CircuitProtection; Package Description: 2-Pin Surface Mount Device, Body 4.55 x 3.24 mm; Manufacturer Part Number 1: 1812L050/30PR
FB1 = 742792097: Ferrite Chip 1000 mA 1500 Ohms Differential Mode - Single 0805 Footprint; Manufacturer: Wurth Electronics; Description in Visual: Ferrite SMT 1000mA 1500Ohm Dif Mode 0805; Usage: Power Supply; Current (mA): 1000; Frequency: 100 MHz; Impedance at Freq (ohms): 1500; DC Resistance (ohms): 0.3; P/N: 742792097; Manufacturer P/N: 742792097; Filter type: Differential Mode - Single; Operating Temperature Range: -55 to +125 °C; PCB Package: 0805; ComponentLink1Description: Manufacturer Website; ComponentLink1URL: http://www.we-online.com; ComponentLink2Description: Component Datasheet; ComponentLink2URL: http://www.we-online.com/eisos/pdf/742792097.pdf; ComponentLink3Description: Octopart Link; ComponentLink3URL: http://octopart.com/partsearch/#search/requestData&q=742792097
L1 L3 = SRN3015-220M: Semi-shielded Power Inductor, 22 uH, +/- 20%, 0.6 A, -40 to 125 degC, 3 x 3 x 1.5 mm SMD, RoHS and Halogen Free, Tape and Reel; Manufacturer: Bourns; SRF Min: 28 MHz; Isat: 0.58 A; Resistance to Solder Heat: +260 degC for 10 sec.; Inductance tolerance: +/- 20%; Inductance: 22 uH; Rated current: 0.6 A; DCR Max: 0.622 Ohm; RoHS: TRUE; ComponentLink1Description: Manufacturer URL; ComponentLink3URL: http://www.bourns.com/data/global/pdfs/SRN3015.pdf; PartNumber: SRN3015-220M; DatasheetVersion: Aug-11; Mounting Technology: Surface Mount; ComponentLink3Description: Package Specification; ComponentLink2Description: Datasheet; Operating Temperature: -40 to 125 degC; PackageDescription: 2-Pin SMD, Body 3 x 3 mm, Height 1.5 mm; Packing: Tape and Reel; PackageReference: SRN3015; ComponentLink2URL: http://www.bourns.com/data/global/pdfs/SRN3015.pdf; ComponentLink1URL: http://www.bourns.com/; Manufacturer 1: Bourns; Manufacturer Part Number 1: SRN3015-220M; Supplier 1: Digi-Key; Supplier Part Number 1: SRN3015-220MCT-ND
L2 = CMP-0222-00041-1: SMD Common Mode Noise Suppressor WE-CNSW, Z = 260 Ohm; Impedance: 260 Ohm; ComponentLink1URL: http://www.we-online.com; PackageDescription: SMD Inductor, 4-Leads, Body 1.4 x 2.2 mm; PackageVersion: 2010; ComponentLink2Description: Datasheet; DatasheetVersion: ver 4, Nov-2010; ComponentLink1Description: Manufacturer Link; PackageReference: WE-CNSW-0805; ComponentLink2URL: http://www.we-online.de/katalog/media/pdf/744231261.pdf
L4 = ACP3225-102-2P-T000: Common Mode Filter, 1000 Ohm Impedance, 1.2 A, 60 V, -40 to 85 degC, 4-Pin SMD, RoHS, Tape and Reel; Manufacturer: TDK; Online Catalog: ACPSeries; Other Names: 445-8637-6; Current: 1.5A; Featured Product: ACP3225SeriesFilter; Number of Lines: 2; Filter Type: PowerLine; Impedance: 1kOhm; DC Resistance (DCR): 50mOhm; Manufacturer URL: http://www.tdk.com/; Package Description: 4-Pin Surface Mount Device, Body 3.2 x 2.5 mm, Pitch 1.15 mm; Datasheet Version: Rev. 8, 07/2011; Package / Case: 1210(3225Metric),4Lead; Packaging: Digi-Reel; Inductance: -; Height (Max): 0.079"(2.00mm); Operating Temperature: -40degC~85degC; Size / Dimension: 0.126"Lx0.098"W(3.20mmx2.50mm); Datasheet URL: https://datasheet.ciiva.com/30106/acp3225-series-30106482.pdf; Standard Package: 1; Series: ACP; Mounting Type: SurfaceMount; Package Reference: ACP3225-102-2P-T000-4; Family: CommonModeChokes; Category: Filters; Manufacturer 1: TDK; Manufacturer Part Number 1: ACP3225-102-2P-T000
NT1 = NET TIE: Net Tie (No BOM)
PS1 = TEL 3-1223: Isolated Module DC DC Converter 2 Output 15V -15V   100mA, 100mA 9V - 18V Input; Supplier 1: Digi-Key; Supplier Part Number 1: 1951-2538-ND
PS2 = NMK1205SC: Isolated Module DC DC Converter 2 Output 5V -5V   200mA, 200mA 10.8V - 13.2V Input; Supplier 1: Digi-Key; Supplier Part Number 1: 811-3393-5-ND
R1 = RES 0805 2 1%: Resistor Surface Mount, 2 Ohms, 0805 Footprint, 1% Tolerance 0.125W; Manufacturer: Various; PCB Package: 0805; Description in Visual: Res SMT 2 0805  1%  0.125W; Value: 2; P/N: RES 0805 2 1%; Manufacturer P/N: Various; Power_Rating: 0.125W; Tolerance: 1%

## Sheet Relay.SchDoc
size Letter; DocumentNumber: 5; SheetNumber: 5; SheetTotal: 7
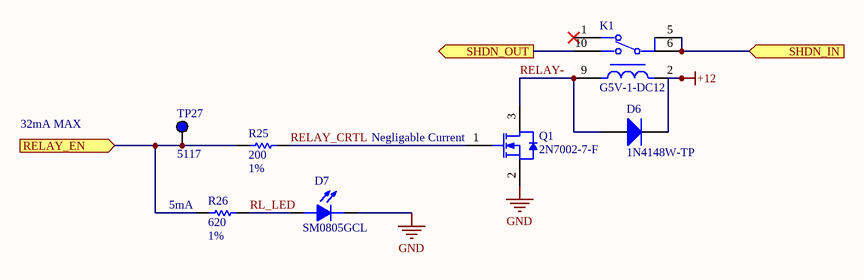
[diagram p4: Relay.SchDoc]

### Parts
D6  1N4148W-TP  [MCC-SOD123_V]
D7  SM0805GCL  [LEDC2012X135N_SM0805GCL(Primary)]
K1  G5V-1-DC12  [Omron_G5V-1-DC12_MFG]
Q1  2N7002-7-F  [DIOD-SOT23-3_V]
R25  Val: 200  Tol: 1%  [0603_RES]  (hidden comment: RES 0603 200 1%)
R26  Val: 620  Tol: 1%  [0603_RES]  (hidden comment: RES 0603 620 1%)
TP27  5117  [KSTN-5117]

### Ports
RELAY_EN (in), SHDN_IN (in), SHDN_OUT (out)

### Nets
+12: D6.2(K) K1.2
GND: D7.C Q1.2(S)
BSPD_OK: R25.1 R26.1 TP27.1 ; port RELAY_EN
RELAY-: D6.1(A) K1.9 Q1.3(D)
RELAY_CRTL: Q1.1(G) R25.2
RL_LED: D7.A R26.2
SHDN_IN: K1.5 K1.6 ; port SHDN_IN
SHDN_OUT: K1.10 ; port SHDN_OUT

Not connected (* = marked no-connect by the designer): K1 1*

### Notes on the sheet
- 32mA MAX
- (near Q1) Negligable Current
- (near R26) 5mA
- Title:
- Size:
- Date:
- Desc:
- Letter
- Auth:
- Sheet
- Proj:
- of
- www.uvmaero.org
- File:

### Library data of the parts
D6 = CMP-2000-04993-1: High Speed Switching Diode, 400 mW, 150 mA, -65 to 150 degC, 2-Pin SOD123, RoHS, Tape and Reel; Manufacturer: Micro Commercial Components; Reverse Recovery Time-Max: 4ns; Average Forward Current-Max: 0.15A; Peak Current-Max: 2A; Power Dissipation: 400mW; Reverse Voltage-Max [Vrrm]: 100V; Datasheet URL: https://datasheet.ciiva.com/16836/1n4148wsod123-16836277.pdf; Package Reference: SOD123; Package URL: http://www.mccsemi.com/up_pdf/1N4448W(SOD-123).pdf; Package Description: 2-Pin Small Outline Diode, Body 2.7 x 1.6 mm, Height 1.35 mm; Manufacturer URL: http://www.mccsemi.com/; Datasheet Version: Rev. C, 07/2014
D7 = SM0805GCL: Green 574nm LED Indication - Discrete 1.9V 0805 (2012 Metric); Supplier 1: Digi-Key; Supplier Part Number 1: 492-2525-1-ND
K1 = G5V-1-DC12: General Purpose Relay SPDT (1 Form C) Through Hole; Manufacturer: Omron; Coil Current: 12.5mA; Coil Power: 150mW; Coil Resistance: 960Ω; Coil Type: Non-Latching; Current Rating: 2A; Number Of Contacts: 1; Standoff Height: 0.5mm; Switching Current: 1A; Verification Version: 0.0.0.1; Datasheet Path: datasheets/Relay_Omron_G5V-1-DC12_eec.pdf; Ambient Temperature Range High: +70°C; Ambient Temperature Range Low: -40°C; Automotive: No; ComponentLink1Description: Upverter; ComponentLink1URL: https://upverter.com/upn/revision/60c0f3c9560d0c93/; ComponentLink2Description: Datasheet; ComponentLink2URL: https://omronfs.omron.com/en_US/ecb/products/pdf/en-g5v_1.pdf; Digikey Description: RELAY GEN PURPOSE SPDT 1A 125V; Digikey Part Number: Z774-ND; Height: 10mm; Lead Free: Yes; Mouser Description: Relay; E-Mech; Low Signal; SPDT; Cur-Rtg 1A; Ctrl-V 12DC; Vol-Rtg 125/60AC/DC; PCB Mnt; Mouser Part Number: 653-G5V-1-DC12; Package: G5V-1-DC12; Part Number: G5V-1-DC12; Price: 1.48127132607; RoHS: TRUE; Supplier 1: Digi-Key; Supplier 2: Mouser; Supplier Part Number 1: Z774-ND; Supplier Part Number 2: 653-G5V-1-DC12; Temperature: -40°C to +70°C; Temperature Range High: +70°C; Temperature Range Low: -40°C; Throw Configuration: SPDT; helpURL: https://upverter.com/upn/revision/60c0f3c9560d0c93/
Q1 = CMP-2000-04929-1: N-Channel Enhancement Mode Field Effect Transistor, 60 V, 0.115 A, -55 to 150 degC, 3-Pin SOT23, RoHS, Tape and Reel; Id - Continuous Drain Current: 115mA; Typical Turn-On Delay Time: 7ns; Typical Turn-Off Delay Time: 11ns; Brand: DiodesIncorporated; Transistor Type: 1N-Channel; Vgs - Gate-Source Voltage: 20V; Rise Time: 3ns; Configuration: Single; Fall Time: 5.6ns; Vds - Drain-Source Breakdown Voltage: 70V; Rds On - Drain-Source Resistance: 7.5Ohms; Number of Channels: 1Channel; Forward Transconductance - Min: 0.08S; Pd - Power Dissipation: 300mW; Unit Weight: 0.000282oz; Datasheet URL: http://datasheet.octopart.com/2N7002-7-F-Diodes-Inc.-datasheet-8326113.pdf; Width: 1.3mm; Series: 2N7002; Length: 2.9mm; Product Category: MOSFET; Minimum Operating Temperature: -55C; Manufacturer URL: http://www.diodes.com/; Mounting Style: SMD/SMT; Package Reference: SOT23-3; Package Description: 3-Pin Small Outline Transistor, Body 2.9 x 1.3 mm, Pitch 0.96 mm; Maximum Operating Temperature: +150C; Transistor Polarity: N-Channel; Factory Pack Quantity: 3000; Technology: Si; Channel Mode: Enhancement; Datasheet Version: Rev. 21-2, 02/2009; Type: EnhancementModeFieldEffectTransistor; RoHS: True; Packaging: Reel; Package / Case: SOT-23-3; Height: 1mm; Product: MOSFETSmallSignal; Manufacturer: DiodesIncorporated
R25 = RES 0603 200 1%: as R19 on sheet LatchDelay; P/N: RES 0603 200 1%; Manufacturer P/N: Various; Power_Rating: 0.1W; Tolerance: 1%
R26 = RES 0603 620 1%: as R15 on sheet LatchDelay; P/N: RES 0603 620 1%; Manufacturer P/N: Various; Power_Rating: 0.1W; Tolerance: 1%
TP27 = 5117: Test Point, Blue, 1-Pin THD, RoHS, Bulk; Manufacturer: KeystoneElectronics; Outside Diameter: 2.54mm; Plating: Silver; Mounting Hole Size: 1mm; Product: TestPoints; Packaging: Bulk; Manufacturer URL: http://www.keyelco.com/; Length: 7.62mm; Datasheet Version: Rev. G, 12/2008; Type: Miniature; Product Category: CircuitBoardHardware-PCB; Material: Nylon; RoHS: True; Contact Material: PhosphorBronze; Datasheet URL: https://ciiva.com/datasheet-click-2917627?src=ciiva&sig=bd195616; Color: Blue; Brand: KeystoneElectronics; Supplier 1: Digi-Key; Supplier Part Number 1: 36-5117-ND